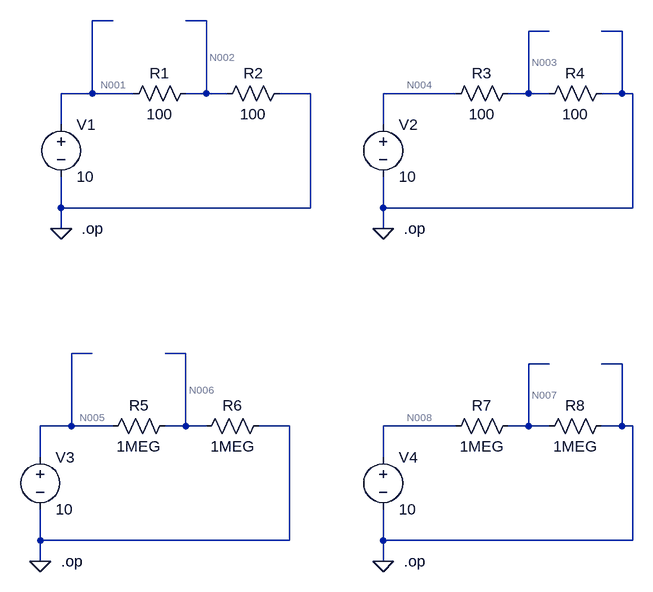
[diagram p0: schematic R_voltmeter=inf.asc]
R_voltmeter=inf.asc, the LTspice schematic file:
Version 4
SHEET 1 996 836
WIRE 80 -16 48 -16
WIRE 224 -16 192 -16
WIRE 752 0 720 0
WIRE 864 0 832 0
WIRE 48 96 48 -16
WIRE 48 96 0 96
WIRE 112 96 48 96
WIRE 224 96 224 -16
WIRE 224 96 192 96
WIRE 256 96 224 96
WIRE 384 96 336 96
WIRE 608 96 496 96
WIRE 720 96 720 0
WIRE 720 96 688 96
WIRE 752 96 720 96
WIRE 864 96 864 0
WIRE 864 96 832 96
WIRE 880 96 864 96
WIRE 0 144 0 96
WIRE 496 144 496 96
WIRE 0 272 0 224
WIRE 384 272 384 96
WIRE 384 272 0 272
WIRE 496 272 496 224
WIRE 880 272 880 96
WIRE 880 272 496 272
WIRE 0 304 0 272
WIRE 496 304 496 272
WIRE 48 496 16 496
WIRE 192 496 160 496
WIRE 752 512 720 512
WIRE 864 512 832 512
WIRE 16 608 16 496
WIRE 16 608 -32 608
WIRE 80 608 16 608
WIRE 192 608 192 496
WIRE 192 608 160 608
WIRE 224 608 192 608
WIRE 352 608 304 608
WIRE 608 608 496 608
WIRE 720 608 720 512
WIRE 720 608 688 608
WIRE 752 608 720 608
WIRE 864 608 864 512
WIRE 864 608 832 608
WIRE 880 608 864 608
WIRE -32 656 -32 608
WIRE 496 656 496 608
WIRE -32 784 -32 736
WIRE 352 784 352 608
WIRE 352 784 -32 784
WIRE 496 784 496 736
WIRE 880 784 880 608
WIRE 880 784 496 784
WIRE -32 816 -32 784
WIRE 496 816 496 784
FLAG 0 304 0
FLAG 496 304 0
FLAG -32 816 0
FLAG 496 816 0
DATAFLAG 80 -16 ""
DATAFLAG 192 -16 ""
DATAFLAG 752 0 ""
DATAFLAG 832 0 ""
DATAFLAG 48 496 ""
DATAFLAG 160 496 ""
DATAFLAG 752 512 ""
DATAFLAG 832 512 ""
SYMBOL voltage 0 128 R0
WINDOW 123 0 0 Left 2
WINDOW 39 0 0 Left 2
SYMATTR InstName V1
SYMATTR Value 10
SYMBOL res 96 112 R270
WINDOW 0 32 56 VTop 2
WINDOW 3 0 56 VBottom 2
SYMATTR InstName R1
SYMATTR Value 100
SYMBOL res 240 112 R270
WINDOW 0 32 56 VTop 2
WINDOW 3 0 56 VBottom 2
SYMATTR InstName R2
SYMATTR Value 100
SYMBOL voltage 496 128 R0
WINDOW 123 0 0 Left 2
WINDOW 39 0 0 Left 2
SYMATTR InstName V2
SYMATTR Value 10
SYMBOL res 592 112 R270
WINDOW 0 32 56 VTop 2
WINDOW 3 0 56 VBottom 2
SYMATTR InstName R3
SYMATTR Value 100
SYMBOL res 736 112 R270
WINDOW 0 32 56 VTop 2
WINDOW 3 0 56 VBottom 2
SYMATTR InstName R4
SYMATTR Value 100
SYMBOL voltage -32 640 R0
WINDOW 123 0 0 Left 2
WINDOW 39 0 0 Left 2
SYMATTR InstName V3
SYMATTR Value 10
SYMBOL res 64 624 R270
WINDOW 0 32 56 VTop 2
WINDOW 3 0 56 VBottom 2
SYMATTR InstName R5
SYMATTR Value 1MEG
SYMBOL res 208 624 R270
WINDOW 0 32 56 VTop 2
WINDOW 3 0 56 VBottom 2
SYMATTR InstName R6
SYMATTR Value 1MEG
SYMBOL voltage 496 640 R0
WINDOW 123 0 0 Left 2
WINDOW 39 0 0 Left 2
SYMATTR InstName V4
SYMATTR Value 10
SYMBOL res 592 624 R270
WINDOW 0 32 56 VTop 2
WINDOW 3 0 56 VBottom 2
SYMATTR InstName R7
SYMATTR Value 1MEG
SYMBOL res 736 624 R270
WINDOW 0 32 56 VTop 2
WINDOW 3 0 56 VBottom 2
SYMATTR InstName R8
SYMATTR Value 1MEG
TEXT 32 304 Left 2 !.op
TEXT 528 304 Left 2 !.op
TEXT 0 816 Left 2 !.op
TEXT 528 816 Left 2 !.op

The netlist it stands for:
* R_voltmeter=inf.asc
V1 N001 0 10
R1 N001 N002 100
R2 N002 0 100
V2 N004 0 10
R3 N004 N003 100
R4 N003 0 100
V3 N005 0 10
R5 N005 N006 1MEG
R6 N006 0 1MEG
V4 N008 0 10
R7 N008 N007 1MEG
R8 N007 0 1MEG
.op
.op
.op
.op
.backanno
.end

* Results of the author's LTspice run, read from the files saved beside the schematic
* Operating Point:
*   V(n001) = 10 V
*   V(n002) = 5 V
*   V(n004) = 10 V
*   V(n003) = 5 V
*   V(n005) = 10 V
*   V(n006) = 5 V
*   V(n008) = 10 V
*   V(n007) = 5 V
*   I(R8) = 5 µA
*   I(R7) = 5 µA
*   I(R6) = 5 µA
*   I(R5) = 5 µA
*   I(R4) = 50 mA
*   I(R3) = 50 mA
*   I(R2) = 50 mA
*   I(R1) = 50 mA
*   I(V4) = -5 µA
*   I(V3) = -5 µA
*   I(V2) = -50 mA
*   I(V1) = -50 mA